# Altium schematic sheet S03.SchDoc: Quad Linear Amplifier
size 381 x 254 mm; Revision: 1.6; SheetNumber: 3; SheetTotal: 9
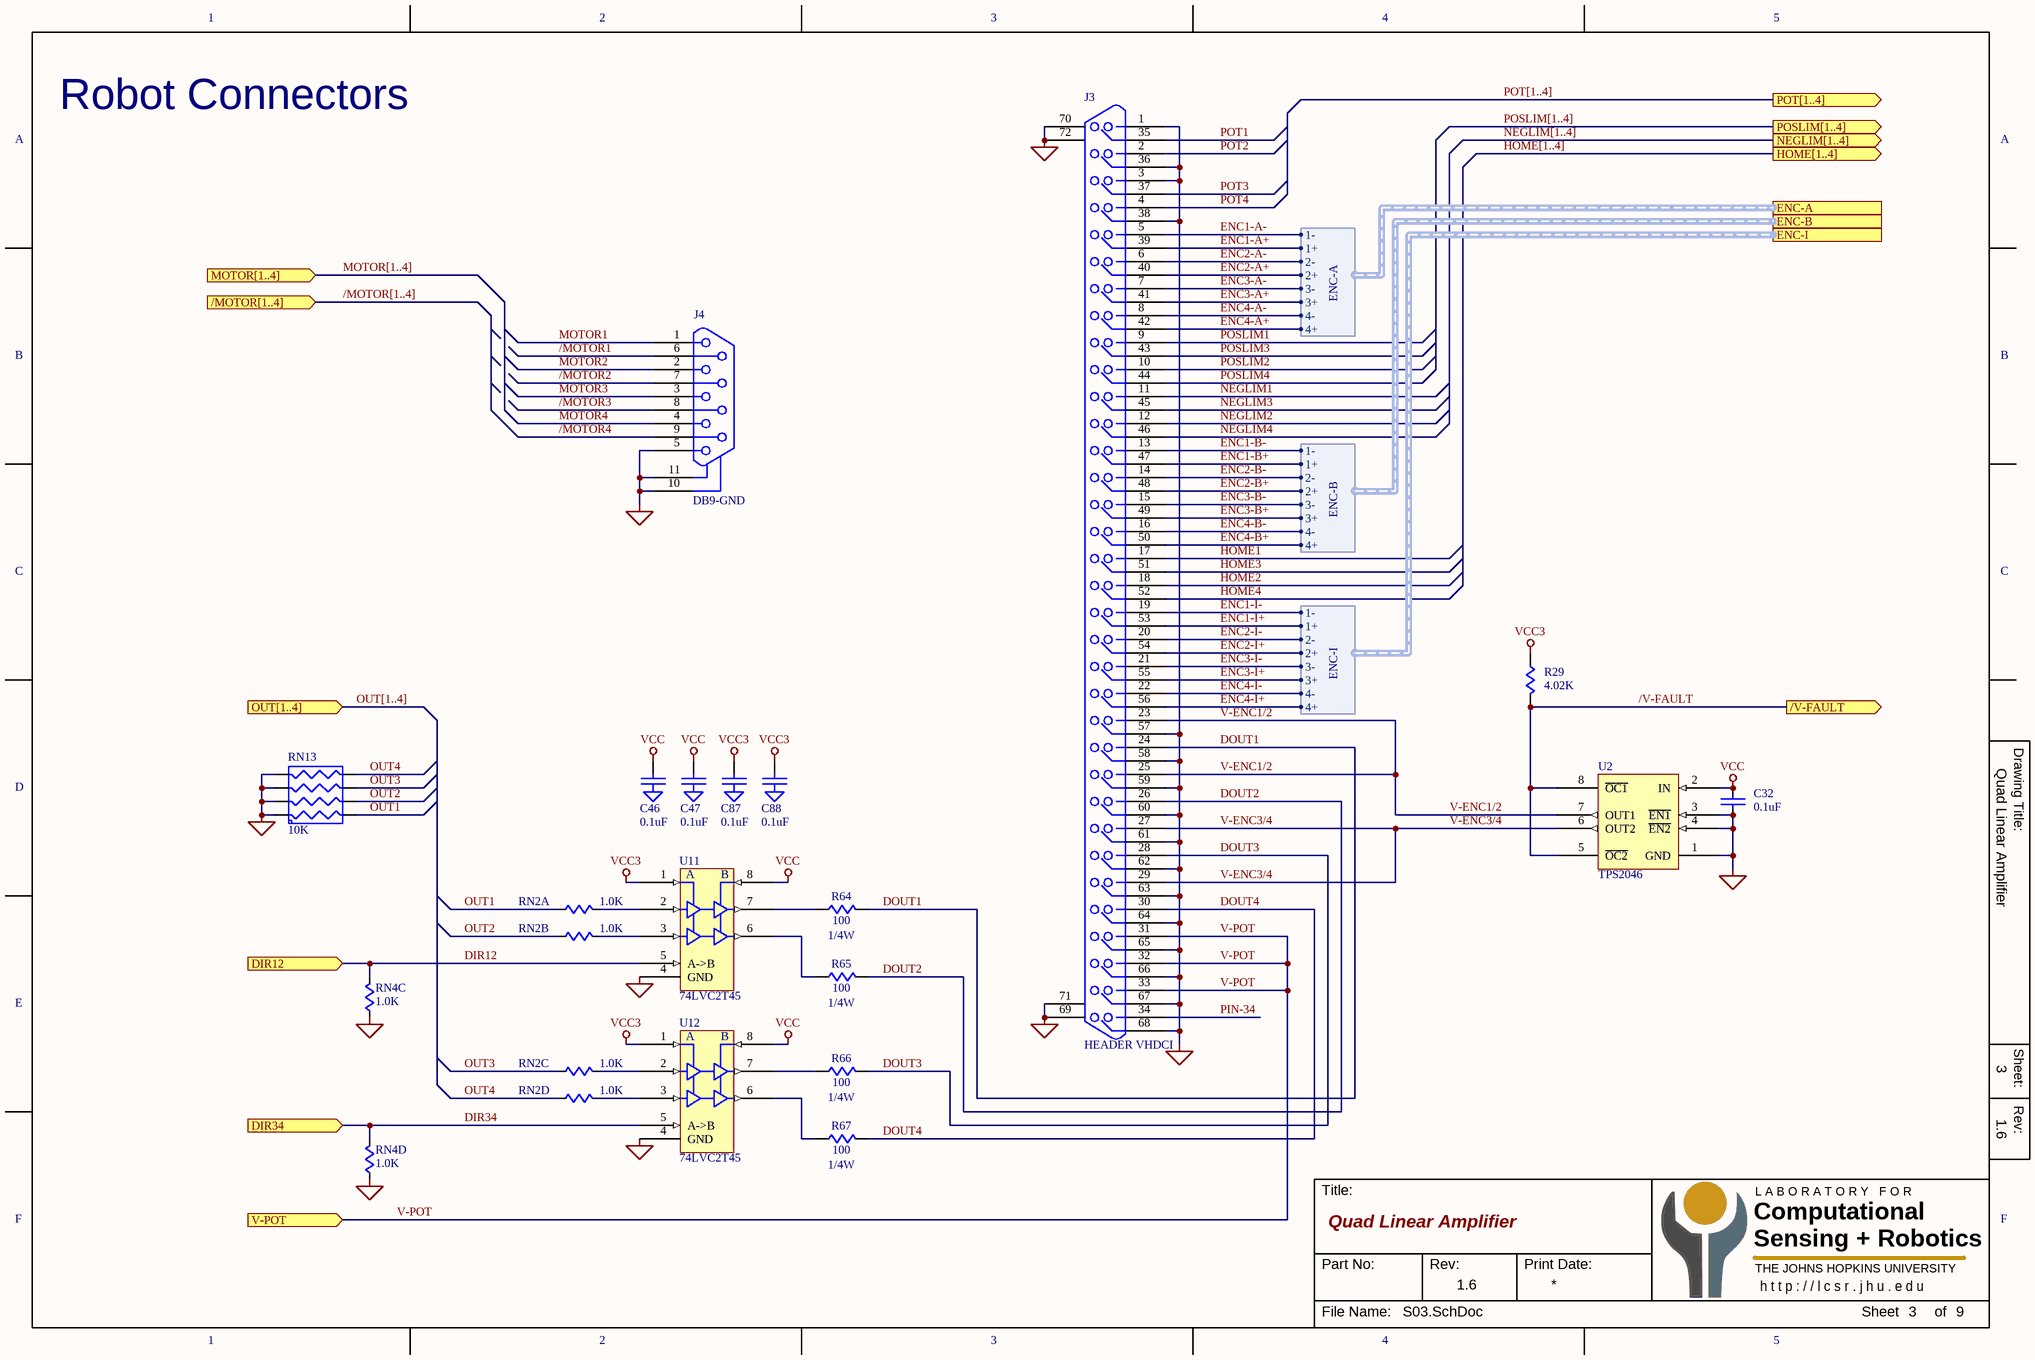
[diagram p0: S03.SchDoc]

## Parts
C32  0.1uF  [C0603]
C46  0.1uF  [C0603]
C47  0.1uF  [C0603]
C87  0.1uF  [C0603]
C88  0.1uF  [C0603]
J3  HEADER VHDCI  [CONN-VHDCI]
J4  DB9-GND  [DB9F/RA-545-HDP]
R29  4.02K  [R0603]
R64  100  [R1206]
R65  100  [R1206]
R66  100  [R1206]
R67  100  [R1206]
RN2  1.0K  [RN-742C083]  (parts A,B,C,D of 4)
RN4  1.0K  [RN-742C083]  (parts C,D of 4)
RN13  10K  [RN-742C083]
U2  TPS2046  [SO-8]
U11  74LVC2T45  [US8-8]
U12  74LVC2T45  [US8-8]

## Ports
/MOTOR[1..4] (in), /V-FAULT (out), DIR12 (in), DIR34 (in), ENC-A (harness ENC-A), ENC-B (harness ENC-B), ENC-I (harness ENC-I), HOME[1..4] (out), MOTOR[1..4] (in), NEGLIM[1..4] (out), OUT[1..4] (in), POSLIM[1..4] (out), POT[1..4] (out), V-POT (in)

## Harnesses
ENC-A: 1-, 1+, 2-, 2+, 3-, 3+, 4-, 4+
ENC-B: 1-, 1+, 2-, 2+, 3-, 3+, 4-, 4+
ENC-I: 1-, 1+, 2-, 2+, 3-, 3+, 4-, 4+

## Nets
GND: C32.2 C46.2(GND) C47.2(GND) C87.2(GND) C88.2(GND) J3.1 J3.3 J3.36 J3.38 J3.57 J3.58 J3.59 J3.60 J3.61 J3.62 J3.63 J3.64 J3.65 J3.66 J3.67 J3.68 J3.69 J3.70 J3.71 J3.72 J4.5 J4.10(GND) J4.11(GND) RN4.3 RN4.4 RN13.1(R1) RN13.2(R2.1) RN13.3(R3.1) RN13.4(R4.1) U2.1(GND) U2.3(~{EN1}) U2.4(~{EN2}) U11.4(GND) U12.4(GND)
VCC: C32.1 C46.1 C47.1 U2.2(IN) U11.8(VCCB) U12.8(VCCB)
VCC3: C87.1 C88.1 R29.1 U11.1(VCCA) U12.1(VCCA)
/MOTOR1: J4.6
/MOTOR2: J4.7
/MOTOR3: J4.8
/MOTOR4: J4.9
/V-FAULT: R29.2 U2.5(~{OC2}) U2.8(~{OC1}) ; port /V-FAULT
DIR12: RN4.6 U11.5(A->B) ; port DIR12
DIR34: RN4.5 U12.5(A->B) ; port DIR34
DOUT1: J3.24 R64.2
DOUT2: J3.26 R65.2
DOUT3: J3.28 R66.2
DOUT4: J3.30 R67.2
ENC1-A+: J3.39 ; port ENC-A.1+
ENC1-A-: J3.5 ; port ENC-A.1-
ENC1-B+: J3.47 ; port ENC-B.1+
ENC1-B-: J3.13 ; port ENC-B.1-
ENC1-I+: J3.53 ; port ENC-I.1+
ENC1-I-: J3.19 ; port ENC-I.1-
ENC2-A+: J3.40 ; port ENC-A.2+
ENC2-A-: J3.6 ; port ENC-A.2-
ENC2-B+: J3.48 ; port ENC-B.2+
ENC2-B-: J3.14 ; port ENC-B.2-
ENC2-I+: J3.54 ; port ENC-I.2+
ENC2-I-: J3.20 ; port ENC-I.2-
ENC3-A+: J3.41 ; port ENC-A.3+
ENC3-A-: J3.7 ; port ENC-A.3-
ENC3-B+: J3.49 ; port ENC-B.3+
ENC3-B-: J3.15 ; port ENC-B.3-
ENC3-I+: J3.55 ; port ENC-I.3+
ENC3-I-: J3.21 ; port ENC-I.3-
ENC4-A+: J3.42 ; port ENC-A.4+
ENC4-A-: J3.8 ; port ENC-A.4-
ENC4-B+: J3.50 ; port ENC-B.4+
ENC4-B-: J3.16 ; port ENC-B.4-
ENC4-I+: J3.56 ; port ENC-I.4+
ENC4-I-: J3.22 ; port ENC-I.4-
HOME1: J3.17
HOME2: J3.18
HOME3: J3.51
HOME4: J3.52
MOTOR1: J4.1
MOTOR2: J4.2
MOTOR3: J4.3
MOTOR4: J4.4
NEGLIM1: J3.11
NEGLIM2: J3.12
NEGLIM3: J3.45
NEGLIM4: J3.46
OUT1: RN2.1 RN13.8(R1.2)
OUT2: RN2.2 RN13.7(R2.2)
OUT3: RN2.3 RN13.6(R3.2)
OUT4: RN2.4 RN13.5(R4.2)
PIN-34: J3.34
POSLIM1: J3.9
POSLIM2: J3.10
POSLIM3: J3.43
POSLIM4: J3.44
POT1: J3.35
POT2: J3.2
POT3: J3.37
POT4: J3.4
V-ENC1/2: J3.23 J3.25 U2.7(OUT1)
V-ENC3/4: J3.27 J3.29 U2.6(OUT2)
V-POT: J3.31 J3.32 J3.33 ; port V-POT
NetR64_1: R64.1 U11.7(B)
NetR65_1: R65.1 U11.6(B)
NetR66_1: R66.1 U12.7(B)
NetR67_1: R67.1 U12.6(B)
NetRN2_5: RN2.5 U12.3(A)
NetRN2_6: RN2.6 U12.2(A)
NetRN2_7: RN2.7 U11.3(A)
NetRN2_8: RN2.8 U11.2(A)

## Buses and harness runs
bus /MOTOR[1..4] = port /MOTOR[1..4]
bus HOME[1..4] = port HOME[1..4]
bus MOTOR[1..4] = port MOTOR[1..4]
bus NEGLIM[1..4] = port NEGLIM[1..4]
bus OUT[1..4] = port OUT[1..4]
bus POSLIM[1..4] = port POSLIM[1..4]
bus POT[1..4] = port POT[1..4]

## Notes on the sheet
- Robot Connectors
- 1
- 2
- 3
- 4
- 5
- A
- B
- C
- Drawing Title:
- D
- E
- Sheet:
- Rev:
- F
- Title:
- Computational
- Sensing + Robotics
- L A B O R A T O R Y   F O R
- Part No:
- Print Date:
- THE JOHNS HOPKINS UNIVERSITY
- h t t p : / / l c s r . j h u . e d u
- File Name:
- Sheet
- of
- (in symbol R) 1/4W

## Library data of the parts
C32 = CAP-MINI
C46 C47 C87 C88 = CAP-GND
J3 = HEADER VHDCI: Molex Part #71430-0008
R29 R64-R67 = R
RN2 RN4 = RN-DISC-SM-4X
RN13 = RN-DISC-SM-4